# EAGLE design multiplexor (EAGLE 6.1)
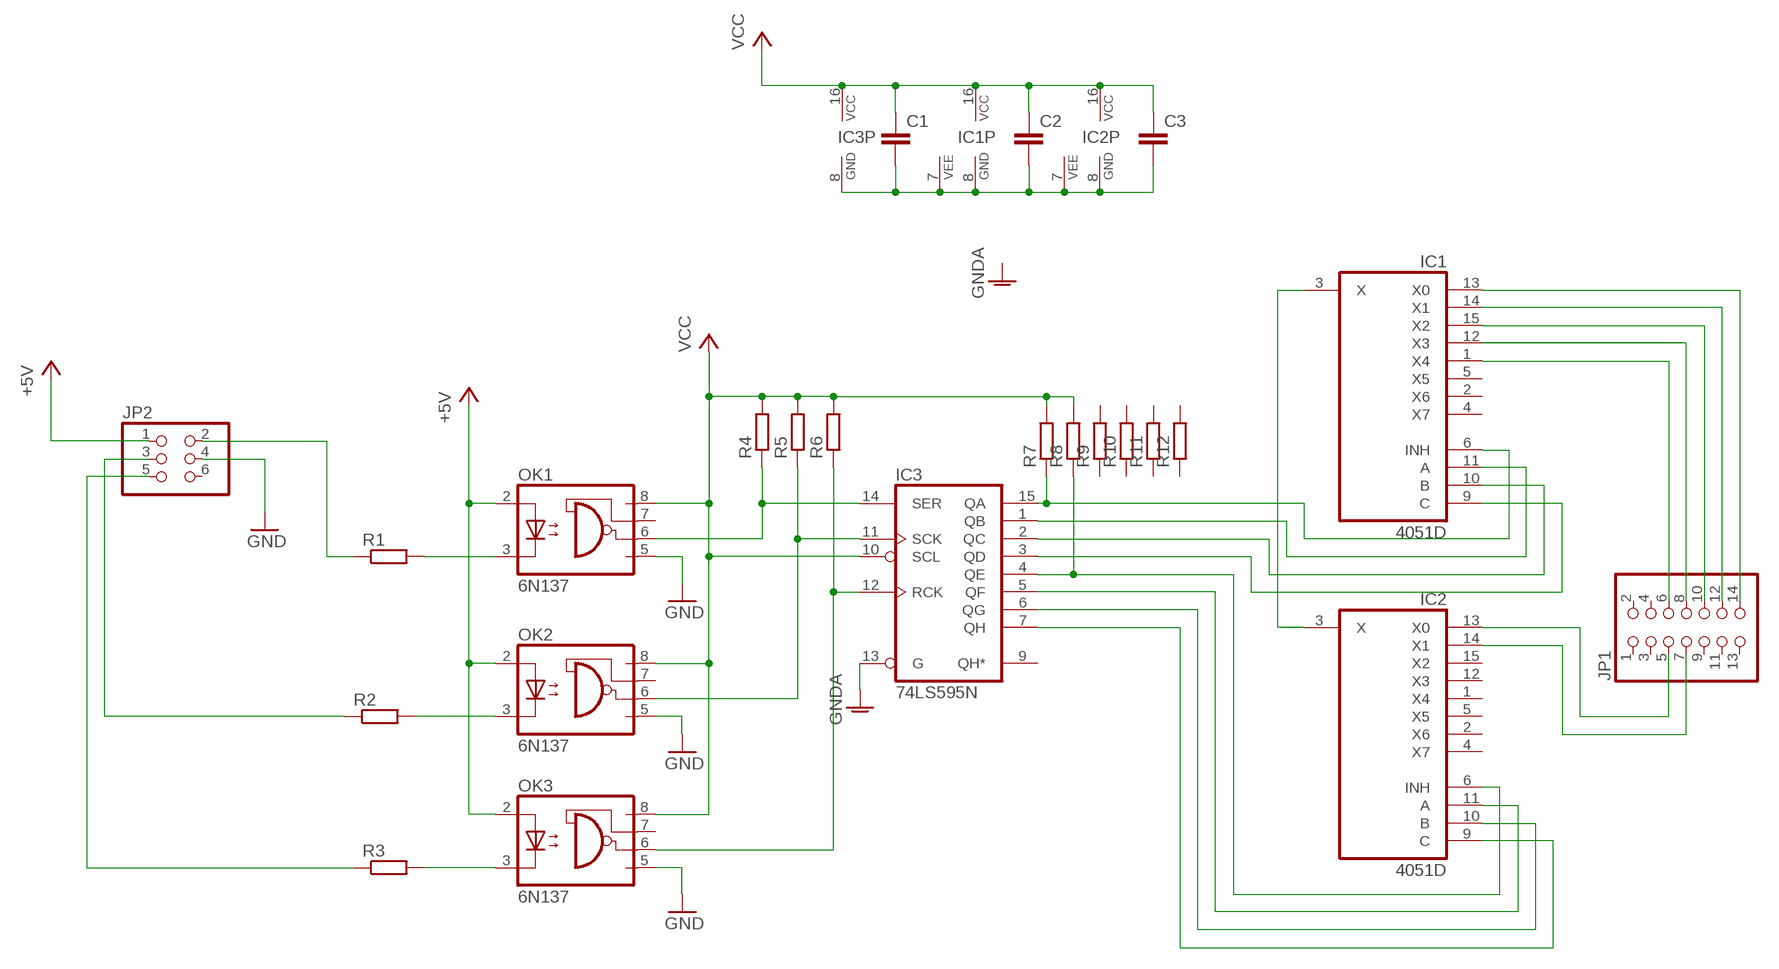
[diagram p0: schematic, sheet 1]

## Parts
C1  C-EUC1206K  [C1206K]
C2  C-EUC1206K  [C1206K]
C3  C-EUC1206K  [C1206K]
IC1  4051D  [SO16]
IC2  4051D  [SO16]
IC3  74LS595N  [DIL16]
JP1  PINHD-2X7  [2X07]
JP2  PINHD-2X3  [2X03]
OK1  6N137  [DIL08]
OK2  6N137  [DIL08]
OK3  6N137  [DIL08]
R1  R-EU_R1206  [R1206]
R2  R-EU_R1206  [R1206]
R3  R-EU_R1206  [R1206]
R4  R-EU_R1206  [R1206]
R5  R-EU_R1206  [R1206]
R6  R-EU_R1206  [R1206]
R7  R-EU_R1206  [R1206]
R8  R-EU_R1206  [R1206]
R9  R-EU_R1206  [R1206]
R10  R-EU_R1206  [R1206]
R11  R-EU_R1206  [R1206]
R12  R-EU_R1206  [R1206]

## Nets
+5V: JP2.1
+6V: IC3.10(SCL) OK1.2(A) OK1.8(VCC) OK2.2(A) OK2.8(VCC) OK3.2(A) OK3.8(VCC) R4.2 R5.2 R6.2 R7.2 R8.2 ; supply symbol labelled VCC, +5V
GND: JP2.4 OK1.5(GND) OK2.5(GND) OK3.5(GND)
GNDA: IC3.13(G)
N$1: IC1.6(INH) IC3.15(QA) R7.1
N$2: IC1.11(A) IC3.1(QB)
N$3: IC1.10(B) IC3.2(QC)
N$4: IC1.9(C) IC3.3(QD)
N$5: IC2.6(INH) IC3.4(QE) R8.1
N$6: IC2.11(A) IC3.5(QF)
N$7: IC2.10(B) IC3.6(QG)
N$8: IC2.9(C) IC3.7(QH)
N$9: IC1.3(X) IC2.3(X)
N$10: IC1.13(X0) JP1.14
N$11: IC1.14(X1) JP1.12
N$12: IC1.15(X2) JP1.10
N$13: IC1.12(X3) JP1.8
N$14: IC1.1(X4) JP1.6
N$15: IC2.13(X0) JP1.5
N$16: IC2.14(X1) JP1.7
N$17: OK1.3(C) R1.2
N$18: OK2.3(C) R2.2
N$19: OK3.3(C) R3.2
N$20: IC3.14(SER) OK1.6(VO) R4.1
N$21: IC3.11(SCK) OK2.6(VO) R5.1
N$22: IC3.12(RCK) OK3.6(VO) R6.1
N$23: JP2.2 R1.1
N$24: JP2.3 R2.1
N$25: JP2.5 R3.1
N$27: C1.2 C2.2 C3.2 IC1.7(VEE) IC1.8(GND) IC2.7(VEE) IC2.8(GND) IC3.8(GND)
VCC: C1.1 C2.1 C3.1 IC1.16(VCC) IC2.16(VCC) IC3.16(VCC)
Unconnected: IC1.2(X6) IC1.4(X7) IC1.5(X5) IC2.1(X4) IC2.2(X6) IC2.4(X7) IC2.5(X5) IC2.12(X3) IC2.15(X2) IC3.9(QH*) JP1.1 JP1.2 JP1.3 JP1.4 JP1.9 JP1.11 JP1.13 JP2.6 OK1.7(VE) OK2.7(VE) OK3.7(VE) R9.1 R9.2 R10.1 R10.2 R11.1 R11.2 R12.1 R12.2

## Library data of the parts
C1-C3 = rcl:C-EU: CAPACITOR, European symbol
IC1 IC2 = 40xx:4051: 8-channel ANALOG MULTIPLEXER
IC3 = 74xx-eu:74*595: 8-bit SHIFT REGISTER, output latch
JP1 = pinhead:PINHD-2X7: PIN HEADER
JP2 = pinhead:PINHD-2X3: PIN HEADER
OK1-OK3 = optocoupler:6N137: MOTOROLA OPTO COUPLER; MPN: 6N137; OC_FARNELL: 1328376; OC_NEWARK: 52M1895
R1-R12 = resistor:R-EU_: RESISTOR, European symbol

## Board
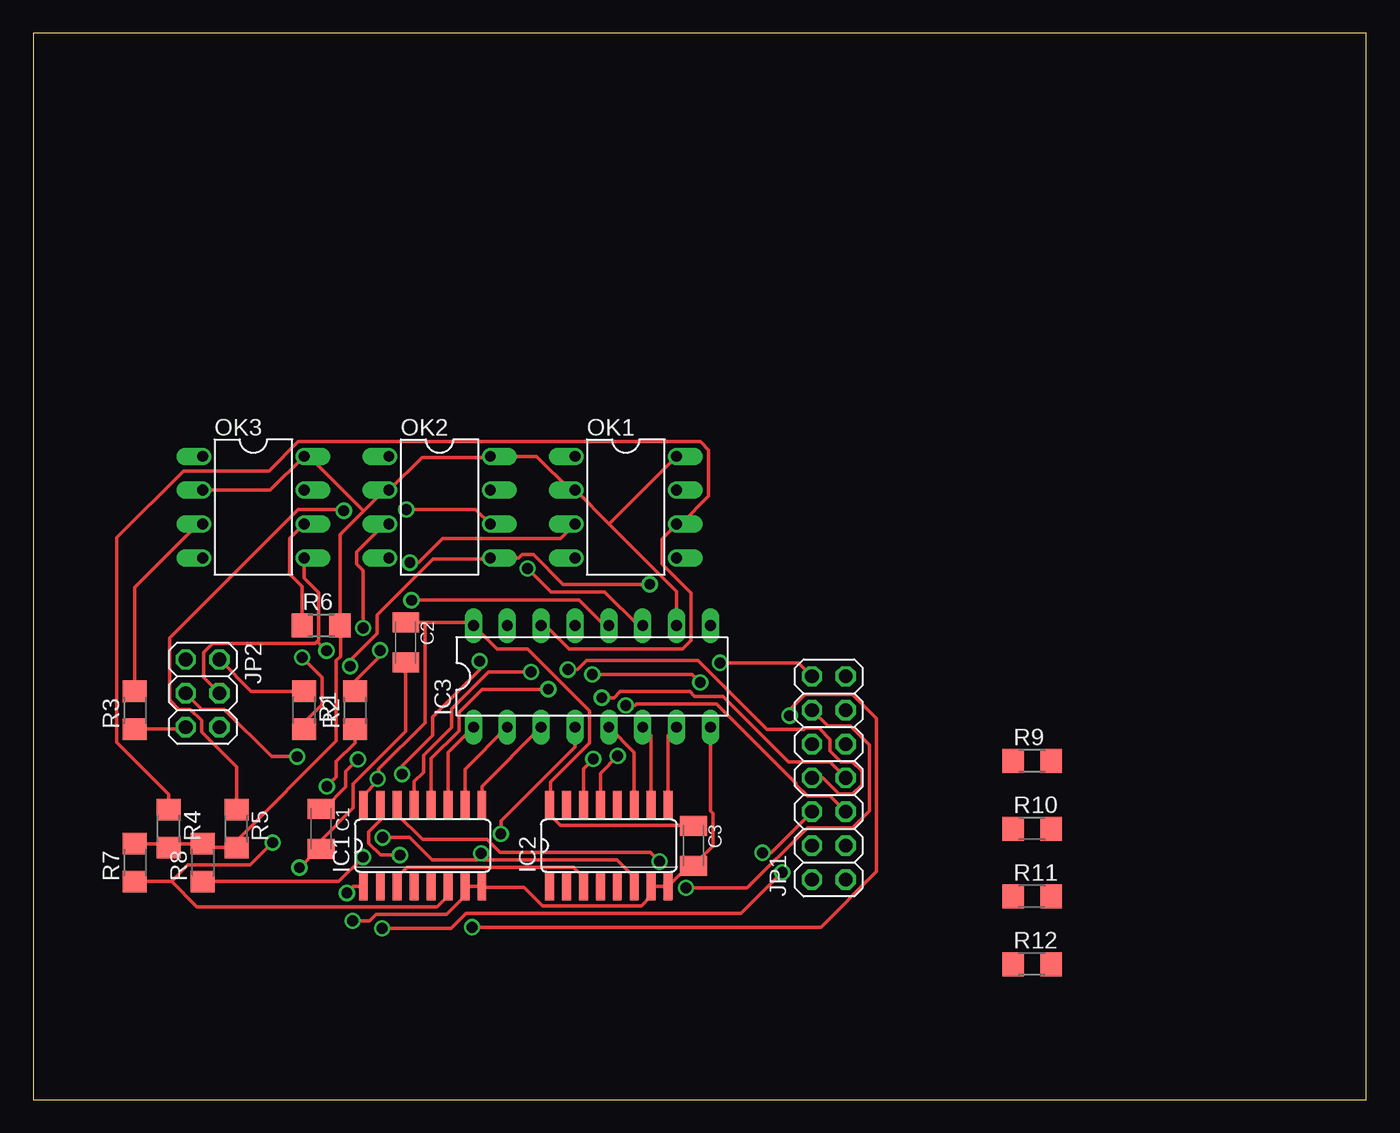
[diagram p1: board, top side]
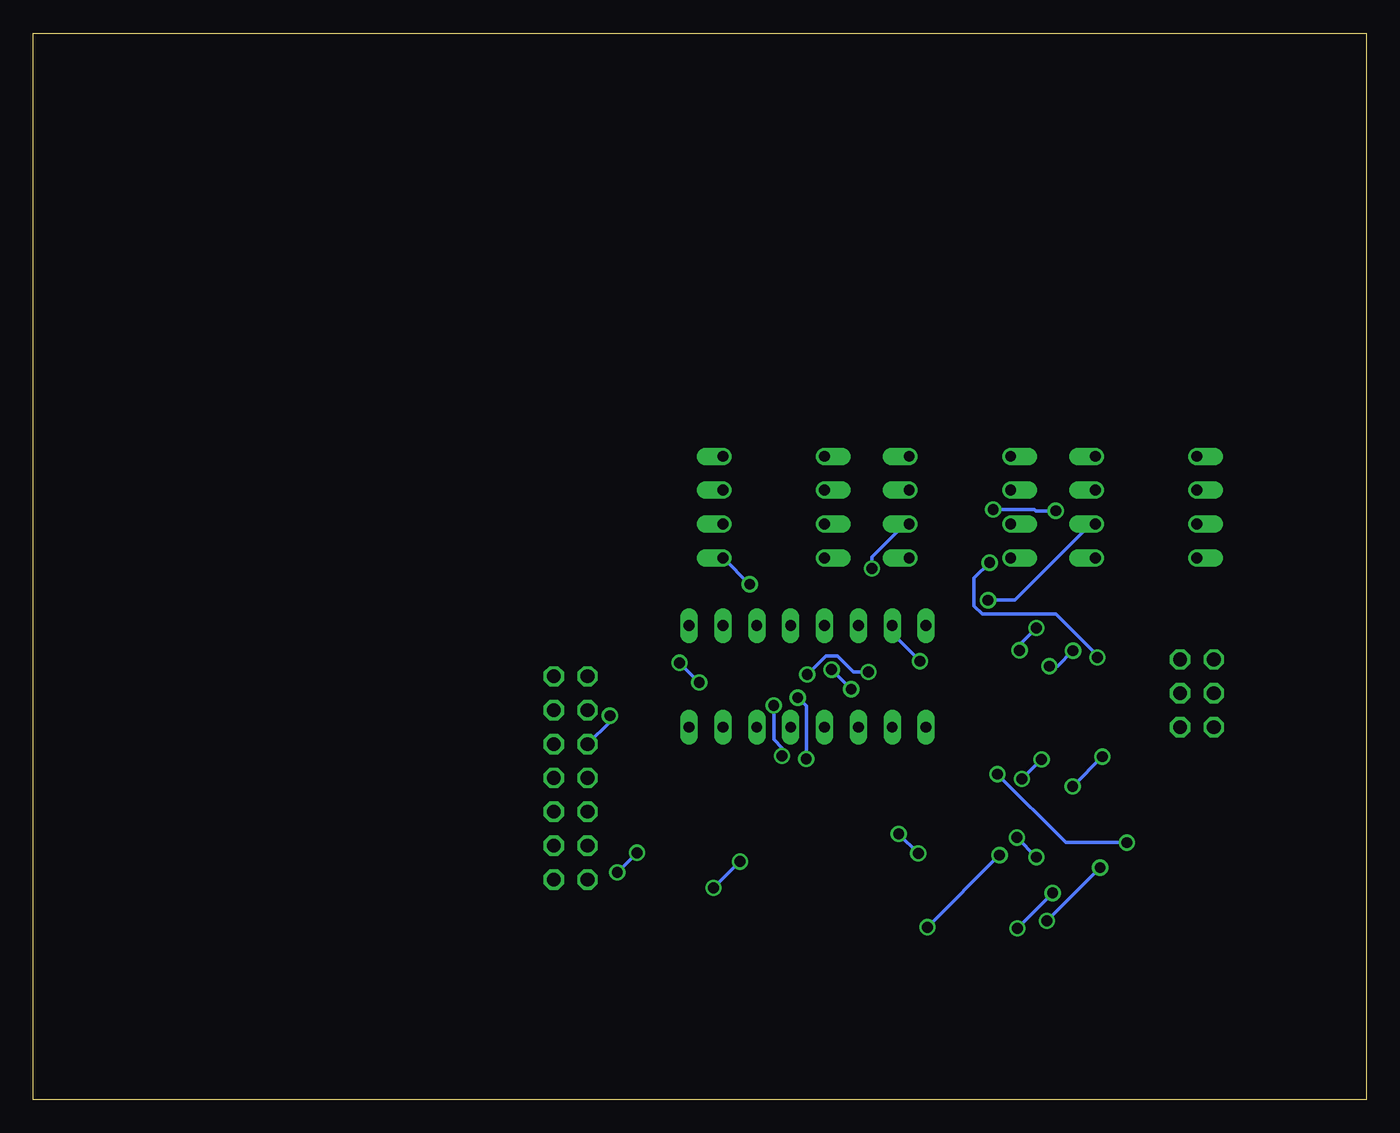
[diagram p2: board, bottom side, seen from below]

Size 100 x 80 mm. Coordinates in mm from the lower left corner, seen from the top.
Outline: 0,0 100,0 100,80 0,80 0,0
Copper layers (1*16): Top 0.035mm / dielectric 1.5mm / Bottom 0.035mm
Design rules: minimum track width 10mil, minimum drill 32mil, track to track 12mil, track to pad 12mil, pad to pad 12mil, via to via 12mil, smd to smd 8mil, copper to edge 40mil, drill to drill 40mil, minimum pad ring 10mil, minimum via ring 8mil, stop-mask expansion 4mil, vias tented up to drill 0mil, thermal gap 14mil

### Footprints (pad centres in the part's own frame; a part is rotated, then mirrored left to right if it is on the bottom)
C1206K = smd 1.5 x 2: 1 -1.5,0; 2 1.5,0
SO16 = smd 0.66 x 2.032: 1 -4.445,-3.073; 2 -3.175,-3.073; 3 -1.905,-3.073; 4 -0.635,-3.073; 5 0.635,-3.073; 6 1.905,-3.073; 7 3.175,-3.073; 8 4.445,-3.073; 9 4.445,3.073; 10 3.175,3.073; 11 1.905,3.073; 12 0.635,3.073; 13 -0.635,3.073; 14 -1.905,3.073; 15 -3.175,3.073; 16 -4.445,3.073
DIL16 = drill 0.813 long: 1 -8.89,-3.81; 2 -6.35,-3.81; 3 -3.81,-3.81; 4 -1.27,-3.81; 5 1.27,-3.81; 6 3.81,-3.81; 7 6.35,-3.81; 8 8.89,-3.81; 9 8.89,3.81; 10 6.35,3.81; 11 3.81,3.81; 12 1.27,3.81; 13 -1.27,3.81; 14 -3.81,3.81; 15 -6.35,3.81; 16 -8.89,3.81
2X07 = drill 1.016 octagon: 1 -7.62,-1.27; 2 -7.62,1.27; 3 -5.08,-1.27; 4 -5.08,1.27; 5 -2.54,-1.27; 6 -2.54,1.27; 7 0,-1.27; 8 0,1.27; 9 2.54,-1.27; 10 2.54,1.27; 11 5.08,-1.27; 12 5.08,1.27; 13 7.62,-1.27; 14 7.62,1.27
2X03 = drill 1.016 octagon: 1 -2.54,-1.27; 2 -2.54,1.27; 3 0,-1.27; 4 0,1.27; 5 2.54,-1.27; 6 2.54,1.27
DIL08 = drill 0.813 offset: 1 -3.81,-3.81; 2 -1.27,-3.81; 3 1.27,-3.81; 4 3.81,-3.81; 5 3.81,3.81; 6 1.27,3.81; 7 -1.27,3.81; 8 -3.81,3.81
R1206 = smd 1.6 x 1.803: 1 -1.422,0; 2 1.422,0

### Placement (x,y rotation side)
C1  21.59,20.32 270 top
C2  27.94,34.29 270 top
C3  49.53,19.05 270 top
IC1  29.21,19.05 0 top
IC2  43.18,19.05 0 top
IC3  41.91,31.75 0 top
JP1  59.69,24.13 90 top
JP2  12.7,30.48 270 top
OK1  44.45,44.45 270 top
OK2  30.48,44.45 270 top
OK3  16.51,44.45 270 top
R1  20.32,29.21 270 top
R2  24.13,29.21 90 top
R3  7.62,29.21 90 top
R4  10.16,20.32 270 top
R5  15.24,20.32 270 top
R6  21.59,35.56 0 top
R7  7.62,17.78 90 top
R8  12.7,17.78 90 top
R9  74.93,25.4 0 top
R10  74.93,20.32 0 top
R11  74.93,15.24 0 top
R12  74.93,10.16 0 top

### Tracks (layer width: path | path; a pad name or v marks a point on that pad's centre or on a via)
+6V
  Top 0.254: IC3.10 48.26,38.12 43.19,43.19 | 43.19,43.19 40.74,45.64 OK1.2 40.31,45.72 37.77,48.26 OK2.8 34.19,48.18 29.16,48.18 26.77,45.8 OK2.2 26.34,45.72 24.78,44.16 | 43.19,43.19 OK1.8 | OK3.2 17.78,45.72 OK3.8 20.42,48.18 20.75,48.18 24.78,44.16 | R7.2 7.62,19.18 9.91,19.18 10.16,18.92 R4.2 10.08,19.18 12.7,19.18 R8.2 12.8,19.1 12.98,18.92 15.24,18.92 R5.2 15.32,19.02 15.32,19.48 22.73,26.9 22.73,32.94 23.04,33.25 23.04,35.46 R6.2 | R6.2 23.01,42.39 24.78,44.16 | R6.2
GND  (via drill 0.81)
  Top 0.254: v46.25,38.66 39.75,38.66 37.52,40.89 36.65,40.89 36.4,40.64 OK2.5 34.19,40.56 30,40.56 25.78,36.35 25.78,34.95 23.77,32.94 v23.77,32.51 | OK3.5 20.32,39.14 21.41,38.05 21.41,34.47 21.31,34.37 | 21.31,34.37 21.16,34.21 13.46,34.21 12.78,33.53 12.78,31.67 JP2.4 | 21.31,34.37 v22,33.68
  Bottom 0.254: v46.25,38.66 48.23,40.64 OK1.5 | v23.77,32.51 23.16,32.51 v22,33.68
N$1  (via drill 0.81)
  Top 0.254: 10.36,16.36 R7.1 | 10.36,16.36 12.27,14.45 30.3,14.45 31.11,15.27 IC1.6 | R7.1 | v33.48,32.89 33.48,32.23 29.95,28.7 29.95,27.3 27.66,25.02 v27.66,24.41 | v17.96,19.28 16.28,17.6 11.58,17.6 10.44,16.46 10.36,16.36
  Bottom 0.254: IC3.15 35.56,34.98 v33.48,32.89 | v27.66,24.41 22.53,19.28 v17.96,19.28
N$2
  Top 0.254: IC1.11 31.11,26.04 IC3.1
N$3
  Top 0.254: IC1.10 32.38,24.77 IC3.2
N$4
  Top 0.254: IC1.9 33.66,23.5 IC3.3
N$5  (via drill 0.81)
  Top 0.254: R8.1 22.91,16.36 v24.74,18.19 | v26.21,19.66 28.25,19.66 29.92,17.98 33.6,17.98 | 33.6,17.98 43.79,17.98 45.09,16.69 IC2.6 | R8.1 | IC3.4 40.64,26.47 35.08,20.9 v35.08,19.94 | 33.6,17.98 v33.6,18.47
  Bottom 0.254: v26.21,19.66 v24.74,18.19 | v33.6,18.47 v35.08,19.94
N$6
  Top 0.254: IC2.11 45.09,26.04 IC3.5
N$7
  Top 0.254: IC2.10 46.35,27.3 IC3.6
N$8
  Top 0.254: IC2.9 47.62,27.3 IC3.7
N$9
  Top 0.254: IC1.3 27.3,16.69 28.04,17.42 40.54,17.42 41.27,16.69 IC2.3
N$10  (via drill 0.81)
  Top 0.254: IC1.13 28.57,23.85 29.29,24.56 29.29,25.83 31.37,27.91 31.37,29.31 34.14,32.08 v37.34,32.08 | v41.94,31.9 49.43,31.9 v50.04,31.29 | v51.51,32.77 57.4,32.77 JP1.14
  Bottom 0.254: v37.34,32.08 38.46,32.08 39.67,33.3 40.54,33.3 v41.94,31.9 | v51.51,32.77 v50.04,31.29
N$11  (via drill 0.81)
  Top 0.254: IC1.14 27.3,21.41 29.21,19.51 34.04,19.51 35,18.54 46.3,18.54 v46.99,17.86 | v48.97,15.88 53.54,15.88 58.06,20.4 61.47,20.4 62.71,21.64 62.71,26.62 61.32,28.02 59.61,28.02 JP1.12
  Bottom 0.254: v48.97,15.88 v46.99,17.86
N$12  (via drill 0.81)
  Top 0.254: IC1.15 26.04,20.95 25.17,20.09 25.17,19.23 26.06,18.34 v27.51,18.34 | v32.92,12.93 59.08,12.93 63.27,17.12 63.27,28.6 61.47,30.4 57.91,30.4 56.74,29.23 v56.74,28.8
  Bottom 0.254: v32.92,12.93 v27.51,18.34 | v56.74,28.8 56.74,28.35 JP1.10
N$13  (via drill 0.81)
  Top 0.254: IC1.12 29.84,25.58 31.93,27.66 31.93,29.06 33.66,30.79 v38.63,30.79 | v40.11,32.26 40.82,32.26 41.5,32.94 49.86,32.94 55.04,27.76 57.81,27.76 57.91,27.86 58.93,27.86 59.77,27.03 59.77,26.16 60.6,25.32 61.47,25.32 62.15,24.64 62.15,23.62 61.47,22.94 60.43,22.94 59.23,24.13 JP1.8
  Bottom 0.254: v40.11,32.26 v38.63,30.79
N$14  (via drill 0.81)
  Top 0.254: IC1.1 24,15.98 v23.52,15.49 | v26.16,12.85 31.34,12.85 32.46,13.97 53.11,13.97 v56.19,17.04 | v54.71,18.52 55.35,18.52 JP1.6
  Bottom 0.254: v26.16,12.85 v23.52,15.49 | v54.71,18.52 v56.19,17.04
N$15  (via drill 0.81)
  Top 0.254: IC2.13 42.55,24.49 v43.84,25.78 | v44.45,29.57 45.14,29.57 45.26,29.69 51.26,29.69 57.23,23.72 57.23,23.62 58.06,22.78 59.77,22.78 JP1.5
  Bottom 0.254: v43.84,25.78 43.84,26.39 44.45,27 v44.45,29.57
N$16  (via drill 0.81)
  Top 0.254: IC2.14 41.27,24.82 v42.01,25.55 | v42.65,30.15 43.56,30.15 44.02,30.61 49.25,30.61 49.61,30.25 51.74,30.25 56.67,25.32 59.77,25.32 JP1.7
  Bottom 0.254: v42.01,25.55 42.01,29.52 v42.65,30.15
N$17  (via drill 0.81)
  Top 0.254: R1.2 20.32,28.3 21.67,29.64 21.67,31.67 v20.17,33.17 | v28.25,40.28 28.91,40.28 30.71,42.09 39.55,42.09 OK1.3
  Bottom 0.254: v20.17,33.17 20.17,33.33 23.27,36.42 28.8,36.42 29.41,37.03 29.41,39.12 v28.25,40.28
N$18  (via drill 0.81)
  Top 0.254: R2.2 24.13,31.39 26.01,33.27 v26.01,33.71 | v24.74,35.38 24.74,39.7 24.26,40.18 24.26,41.1 26.34,43.18 OK2.3
  Bottom 0.254: v26.01,33.71 26.01,34.11 v24.74,35.38
N$19
  Top 0.254: R3.2 7.62,38.43 12.37,43.18 OK3.3
N$20
  Top 0.254: R4.1 10.16,22.91 6.27,26.8 6.27,42.16 11.28,47.17 17.68,47.17 19.86,49.35 50.04,49.35 50.67,48.72 50.67,45.26 48.59,43.18 OK1.6 48.18,43.08 47.17,42.06 47.17,40.18 49.35,38 49.35,34.44 48.72,33.81 40.18,33.81 38.43,35.56 IC3.14
N$21  (via drill 0.81)
  Top 0.254: R5.1 15.24,24.97 12.62,27.58 12.62,28.45 11.79,29.29 10.92,29.29 10.24,29.97 10.24,34.65 19.86,44.27 23.19,44.27 v23.29,44.17 | v27.99,44.27 33.2,44.27 OK2.6 | IC3.11 45.39,35.56 42.85,38.1 38.84,38.1 v37.08,39.85
  Bottom 0.254: v23.29,44.17 24.79,44.17 24.89,44.27 v27.99,44.27 | v37.08,39.85 37.08,40.72 34.62,43.18 OK2.6
N$22  (via drill 0.81)
  Top 0.254: R6.1 20.17,38.48 19.23,39.42 19.23,42.09 OK3.6 | R6.1 | IC3.12 42.85,35.56 40.95,37.47 v28.37,37.47
  Bottom 0.254: v28.37,37.47 26.36,37.47 20.65,43.18 OK3.6
N$23
  Top 0.254: R1.1 16.36,30.63 JP2.2 | R1.1
N$24  (via drill 0.81)
  Top 0.254: R2.1 24.13,26.77 22.73,25.38 22.73,24.21 v22.02,23.5 | v19.79,25.73 17.88,25.73 14.33,29.29 12.62,29.29 JP2.3
  Bottom 0.254: v19.79,25.73 v22.02,23.5
N$25
  Top 0.254: JP2.5 11.3,27.81 7.62,27.81 R3.1
N$27  (via drill 0.81)
  Top 0.254: C2.2 27.94,27.64 24,23.7 24,21.87 21.59,19.46 C1.2 21.49,18.75 21.31,18.75 v19.96,17.4 | IC3.8 50.8,21.64 50.98,21.46 50.98,19.02 49.61,17.65 C3.2 49.53,17.53 49.15,17.53 47.62,16 IC2.8 IC2.7 46.28,15.88 46.28,15.19 45.62,14.53 38.2,14.53 36.83,15.9 33.76,15.9 IC1.8 IC1.7 32.31,15.88 32.31,15.19 31.01,13.89 25.73,13.89 25.25,13.41 v23.95,13.41
  Bottom 0.254: v23.95,13.41 v19.96,17.4
VCC  (via drill 0.81)
  Top 0.254: C3.1 49.53,20.57 39.57,20.57 38.73,21.41 IC2.16 38.81,22.23 38.81,23.82 41.73,26.75 41.73,29.16 37.08,33.81 34.8,33.81 33.12,35.48 IC3.16 32.79,35.79 29.39,35.79 | v24.36,25.53 23.44,24.61 23.44,23.44 21.84,21.84 21.59,21.84 C1.1 | IC1.16 24.77,22.84 25.83,23.9 v25.83,24.05 25.91,24.16 25.91,24.79 29.39,28.27 29.39,35.79 | 29.39,35.79 C2.1
  Bottom 0.254: v25.83,24.05 v24.36,25.53